# Altium project DD2090_4CAM_FFC_R2M1E2.PrjPcb (part 5 of 5)

## Sheet DD2090_4CAM_FFC_Connector_B.SchDoc: =project_title
size Tabloid; CompanyName: Luxonis Holding; DrawnBy: Dan Dunga; Organization: Luxonis Holding; Address1: 1925 Harmony Park Drive; Address2: Westminster, CO; Address3: 80234; Address4: United States; DocumentNumber: D0000190; SheetNumber: 4; SheetTotal: 12
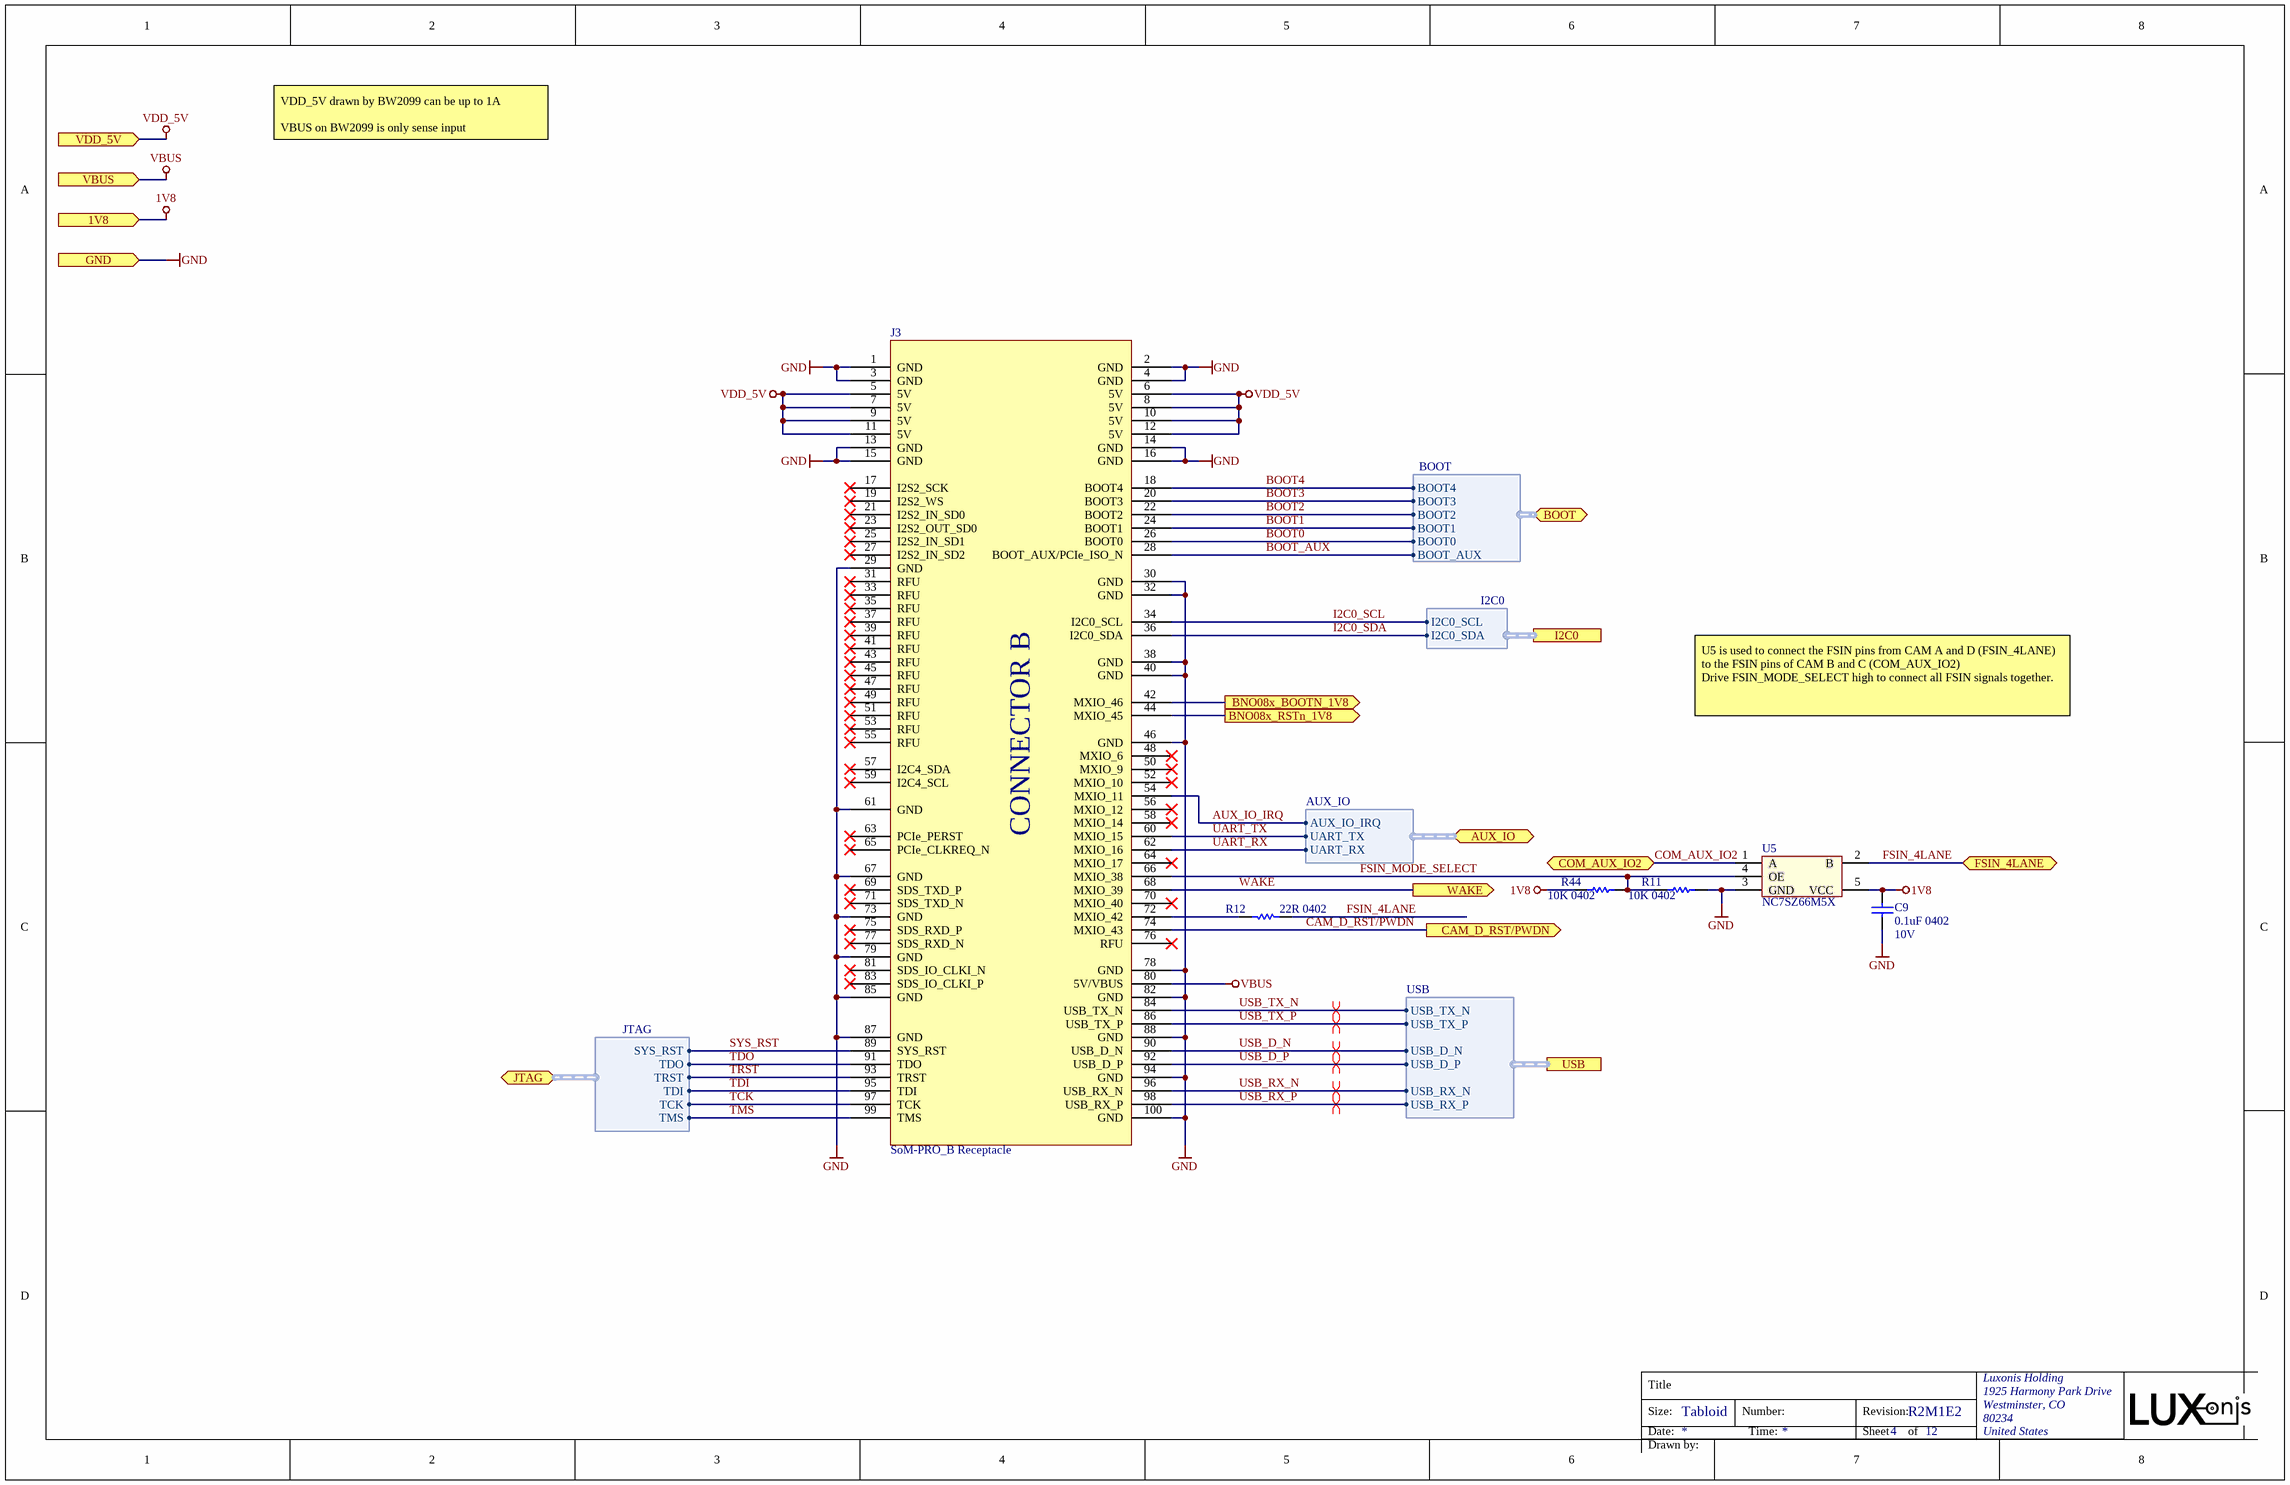
[diagram p9: DD2090_4CAM_FFC_Connector_B.SchDoc]

### Parts
C9  0.1uF 0402  Voltage Rating: 10V  [CAPC0402(1005)70_L]
J3  SoM-PRO_B Receptacle  [CON_B_BW2099_SoM_DF40HC-3.0-100DS-0.4V_minpad]
R11  10K 0402  [RESC0402(1005)_L]
R12  22R 0402  [RESC0402(1005)_N]
R44  10K 0402  [RESC0402(1005)_L]
U5  NC7SZ66M5X  [SOT235]

### Ports
1V8 (in), AUX_IO (bidir, harness AUX_IO), BNO08x_BOOTN_1V8 (out), BNO08x_RSTn_1V8 (out), BOOT (bidir, harness BOOT), CAM_D_RST/PWDN (out), COM_AUX_IO2 (bidir), FSIN_4LANE (bidir), GND (in), I2C0 (harness I2C0), JTAG (bidir, harness JTAG), USB (harness USB), VBUS (in), VDD_5V (in), WAKE (out)

### Harnesses
JTAG: SYS_RST, TDO, TRST, TDI, TCK, TMS
USB: USB_TX_N, USB_TX_P, USB_RX_N, USB_RX_P, USB_D_P, USB_D_N
BOOT: BOOT4, BOOT3, BOOT2, BOOT1, BOOT0, BOOT_AUX
AUX_IO: AUX_IO_IRQ, UART_TX, UART_RX
I2C0: I2C0_SCL, I2C0_SDA

### Nets
1V8: C9.2 R44.2 U5.5(VCC) ; port 1V8
GND: C9.1 J3.1(GND) J3.2(GND) J3.3(GND) J3.4(GND) J3.13(GND) J3.14(GND) J3.15(GND) J3.16(GND) J3.29(GND) J3.30(GND) J3.32(GND) J3.38(GND) J3.40(GND) J3.46(GND) J3.61(GND) J3.67(GND) J3.73(GND) J3.78(GND) J3.79(GND) J3.82(GND) J3.85(GND) J3.87(GND) J3.88(GND) J3.94(GND) J3.100(GND) R11.1 U5.3(GND) ; port GND
VBUS: J3.80(5V/VBUS) ; port VBUS
VDD_5V: J3.5(5V) J3.6(5V) J3.7(5V) J3.8(5V) J3.9(5V) J3.10(5V) J3.11(5V) J3.12(5V) ; port VDD_5V
AUX_IO_IRQ: J3.54(MXIO_11) ; port AUX_IO.AUX_IO_IRQ
BNO08x_BOOTN_1V8: J3.42(MXIO_46) ; port BNO08x_BOOTN_1V8
BNO08x_RSTn_1V8: J3.44(MXIO_45) ; port BNO08x_RSTn_1V8
BOOT0: J3.26(BOOT0) ; port BOOT.BOOT0
BOOT1: J3.24(BOOT1) ; port BOOT.BOOT1
BOOT2: J3.22(BOOT2) ; port BOOT.BOOT2
BOOT3: J3.20(BOOT3) ; port BOOT.BOOT3
BOOT4: J3.18(BOOT4) ; port BOOT.BOOT4
BOOT_AUX: J3.28(BOOT_AUX/PCIe_ISO_N) ; port BOOT.BOOT_AUX
CAM_D_RST/PWDN: J3.74(MXIO_43) ; port CAM_D_RST/PWDN  [project net CAM2_RST]
COM_AUX_IO2: U5.1(A) ; port COM_AUX_IO2
FSIN_4LANE: R12.1 U5.2(B) ; port FSIN_4LANE
FSIN_MODE_SELECT: J3.66(MXIO_38) R11.2 R44.1 U5.4(OE)
I2C0_SCL: J3.34(I2C0_SCL) ; port I2C0.I2C0_SCL
I2C0_SDA: J3.36(I2C0_SDA) ; port I2C0.I2C0_SDA
SYS_RST: J3.89(SYS_RST) ; port JTAG.SYS_RST
TCK: J3.97(TCK) ; port JTAG.TCK
TDI: J3.95(TDI) ; port JTAG.TDI
TDO: J3.91(TDO) ; port JTAG.TDO
TMS: J3.99(TMS) ; port JTAG.TMS
TRST: J3.93(TRST) ; port JTAG.TRST
UART_RX: J3.62(MXIO_16) ; port AUX_IO.UART_RX
UART_TX: J3.60(MXIO_15) ; port AUX_IO.UART_TX
USB_D_N: J3.90(USB_D_N) ; port USB.USB_D_N
USB_D_P: J3.92(USB_D_P) ; port USB.USB_D_P
USB_RX_N: J3.96(USB_RX_N) ; port USB.USB_RX_N
USB_RX_P: J3.98(USB_RX_P) ; port USB.USB_RX_P
USB_TX_N: J3.84(USB_TX_N) ; port USB.USB_TX_N
USB_TX_P: J3.86(USB_TX_P) ; port USB.USB_TX_P
WAKE: J3.68(MXIO_39) ; port WAKE
NetJ3_72: J3.72(MXIO_42) R12.2

Not connected (* = marked no-connect by the designer): J3 17(I2S2_SCK)* 19(I2S2_WS)* 21(I2S2_IN_SD0)* 23(I2S2_OUT_SD0)* 25(I2S2_IN_SD1)* 27(I2S2_IN_SD2)* 31(RFU)* 33(RFU)* 35(RFU)* 37(RFU)* 39(RFU)* 41(RFU)* 43(RFU)* 45(RFU)* 47(RFU)* 48(MXIO_6)* 49(RFU)* 50(MXIO_9)* 51(RFU)* 52(MXIO_10)* 53(RFU)* 55(RFU)* 56(MXIO_12)* 57(I2C4_SDA)* 58(MXIO_14)* 59(I2C4_SCL)* 63(PCIe_PERST)* 64(MXIO_17)* 65(PCIe_CLKREQ_N)* 69(SDS_TXD_P)* 70(MXIO_40)* 71(SDS_TXD_N)* 75(SDS_RXD_P)* 76(RFU)* 77(SDS_RXD_N)* 81(SDS_IO_CLKI_N)* 83(SDS_IO_CLKI_P)*

### Layout directives
differential pair; differential pair class 90ohm: USB_D_N, USB_D_P, USB_RX_N, USB_RX_P, USB_TX_N, USB_TX_P

### Notes on the sheet
- VDD_5V drawn by BW2099 can be up to 1A
  VBUS on BW2099 is only sense input
- U5 is used to connect the FSIN pins from CAM A and D (FSIN_4LANE) to the FSIN pins of CAM B and C (COM_AUX_IO2)
  Drive FSIN_MODE_SELECT high to connect all FSIN signals together.
- Title
- Size:
- Date:
- Tabloid
- Number:
- Time:
- Revision:
- Sheet
- of
- Drawn by:
- (in symbol DF40HC(3.0)-100DS-0.4V_SoM-PRO_B) CONNECTOR B

### Library data of the parts
C9 = GRM155R71A104JA01D: CAP CER 0.1UF 10V X7R 0402 5%; Manufacturer 1: Murata; Capacitance: 100nF; Supplier 1: Digi-Key; Manufacturer Part Number 1: GRM155R71A104JA01D; Stock 1: 1346709; Pricing 1: 1=0.10000, 10=0.02500, 100=0.01130, 500=0.00806, 1000=0.00633, 2500=0.00575, 5000=0.00529 (USD); RoHS: Yes; Mount: Surface Mount; Case/Package: 0402; Case Code (Imperial): 0402; Case Code (Metric): 1005; Min Operating Temperature: -55°C; Max Operating Temperature: 125°C; Tolerance: 5%; Packaging: Tape and Reel; Voltage Rating (DC): 10V; Dielectric: X7R; Package Quantity: 10000; Termination: SMD/SMT; Length: 1mm; Height: 0.5mm; Width: 0.02inch; Thickness: 0.022inch; Depth: 0.5mm; Radiation Hardening: No; Lead Free: Lead Free; ComponentLink1URL: https://datasheet.ciiva.com/5411/product-5411135.pdf?src-supplier=Mouser; ComponentLink1Description: https://datasheet.ciiva.com/5411/product-5411135.pdf?src-supplier=Mouser; ComponentLink2URL: https://datasheet.ciiva.com/11618/c02e-11618821.pdf?src-supplier=Avnet; ComponentLink2Description: https://datasheet.ciiva.com/11618/c02e-11618821.pdf?src-supplier=Avnet; Supplier Part Number 1: 490-10777-1-ND
J3 = DF40HC(3.0)-100DS-0.4V_SoM-PRO_B: CONN RCPT 100POS 0.4MM SMD GOLD; Manufacturer 1: Hirose; Manufacturer Part Number 1: DF40HC(3.0)-100DS-0.4V(58); Number of Positions: 100; Pitch: 0.016inch; System: Connector; RoHS: Yes; Mount: Surface Mount; Contact Plating: Gold; Packaging: Tape and Reel; Number of Rows: 2; Package Quantity: 1000; Connector Type: Receptacle; Lead Free: Lead Free; ComponentLink1URL: https://datasheet.ciiva.com/46636/ed-df40-20140305-46636517.pdf?src-supplier=Digi-Key; ComponentLink1Description: https://datasheet.ciiva.com/46636/ed-df40-20140305-46636517.pdf?src-supplier=Digi-Key; ComponentLink2URL: https://datasheet.ciiva.com/18562/ed-df40-20140305-18562189.pdf?src-supplier=Digi-Key; ComponentLink2Description: https://datasheet.ciiva.com/18562/ed-df40-20140305-18562189.pdf?src-supplier=Digi-Key; ComponentLink3URL: https://datasheet.ciiva.com/13559/ed-df40-20140305-13559540.pdf?src-supplier=Mouser; ComponentLink3Description: https://datasheet.ciiva.com/13559/ed-df40-20140305-13559540.pdf?src-supplier=Mouser; ComponentLink4URL: https://datasheet.ciiva.com/18562/ed-df40-20140305-18562462.pdf?src-supplier=Digi-Key; ComponentLink4Description: https://datasheet.ciiva.com/18562/ed-df40-20140305-18562462.pdf?src-supplier=Digi-Key; Supplier 1: Mouser; Stock 1: 2172; Pricing 1: 1=2.54000, 10=2.26000, 25=2.07000, 50=2.07000, 100=1.98000, 250=1.79000, 500=1.65000, 1000=1.41000, 3000=1.32000, 6000=1.23000, 10000=1.23000 (USD); Supplier 2: Mouser; Stock 2: 2078; Pricing 2: 1=2.50000, 10=2.40000, 25=2.10000, 50=2.10000, 100=2.00000, 250=1.76000, 500=1.71000, 1000=1.45000, 2000=1.36000, 5000=1.31000, 10000=1.31000 (USD); Supplier Part Number 1: 798-DF40HC30100DS451; Supplier Part Number 2: 798-DF40HC30100DS458
R11 R44 = RC0402FR-1310KL: RES SMD 10K OHM 1% 0402 1/16W Chip Resistor, 0402 [1005 Metric], 10 kohm, RC Series, 50 V, Thick Film, 62.5 mW; Manufacturer 1: Yageo; Resistance: 10kR; Temperature Coefficient: 100ppm/°C; Power Rating: 62.5mW; Voltage Rating: 50V; ComponentLink1URL: https://datasheet.ciiva.com/16940/pyu-rc0402-51-rohs-l-6-16940293.pdf?src-supplier=Avnet+Europe; ComponentLink1Description: https://datasheet.ciiva.com/16940/pyu-rc0402-51-rohs-l-6-16940293.pdf?src-supplier=Avnet+Europe; ComponentLink2URL: https://datasheet.ciiva.com/28386/pyu-rc0402-51-rohs-l-6-28386855.pdf?src-supplier=Avnet+Europe; ComponentLink2Description: https://datasheet.ciiva.com/28386/pyu-rc0402-51-rohs-l-6-28386855.pdf?src-supplier=Avnet+Europe; ComponentLink3URL: https://datasheet.ciiva.com/16740/pyu-rc0402-51-rohs-l-6-r-16740602.pdf?src-supplier=Future+Electronics; ComponentLink3Description: https://datasheet.ciiva.com/16740/pyu-rc0402-51-rohs-l-6-r-16740602.pdf?src-supplier=Future+Electronics; ComponentLink4URL: https://datasheet.ciiva.com/8891/pyu-rc0402-51-rohs-l-6-8891339.pdf?src-supplier=Avnet; ComponentLink4Description: https://datasheet.ciiva.com/8891/pyu-rc0402-51-rohs-l-6-8891339.pdf?src-supplier=Avnet; ComponentLink5URL: https://datasheet.ciiva.com/5557/pyu-rc0402-51-rohs-l-6-r-5557997.pdf?src-supplier=Mouser; ComponentLink5Description: https://datasheet.ciiva.com/5557/pyu-rc0402-51-rohs-l-6-r-5557997.pdf?src-supplier=Mouser; ComponentLink6URL: https://datasheet.ciiva.com/7983/1018594-7983533.pdf?src-supplier=Element14; ComponentLink6Description: https://datasheet.ciiva.com/7983/1018594-7983533.pdf?src-supplier=Element14; Supplier 1: Newark; Manufacturer Part Number 1: RC0402FR-1310KL; Stock 1: 62239; Pricing 1: 1=0.10000, 25=0.01200, 100=0.00400, 250=0.00400, 500=0.00300, 1000=0.00300 (USD); RoHS: Yes; Case/Package: 0402; Number of Pins: 2; Contact Plating: Tin,Matte,Lead; Case Code (Imperial): 0402; Case Code (Metric): 1005; Min Operating Temperature: -55°C; Max Operating Temperature: 155°C; Tolerance: 1%; Composition: Thick Film; Packaging: Tape and Reel; Termination: SMD/SMT; Military Standard: Not; Voltage Rating (DC): 50V; Working Voltage: 50V; Number of Terminations: 2; Length: 1mm; Depth: 0.5mm; Radiation Hardening: No; REACH SVHC: No SVHC; Lead Free: Lead Free; Supplier Part Number 1: 67R9960; Supplier 2: Future Electronics; Supplier 3: Mouser; Supplier 4: Element14; Supplier Part Number 2: RC0402FR-1310KL-CUTT; Supplier Part Number 3: 603-RC0402FR-1310KL; Supplier Part Number 4: 1799235
R12 = RC0402FR-0722RL: RES SMD 22 OHM 1% 1/16W 0402; Manufacturer 1: Yageo; Temperature Coefficient: 100ppm/°C; Power Rating: 63mW; Voltage Rating: 50V; Supplier 1: Digi-Key; Manufacturer Part Number 1: RC0402FR-0722RL; Stock 1: 23751364; Pricing 1: 10000=0.00163, 30000=0.00144, 50000=0.00132, 100000=0.00129 (USD); RoHS: Yes; Case/Package: 0402; Number of Pins: 2; Case Code (Metric): 1005; Case Code (Imperial): 0402; Min Operating Temperature: -55°C; Max Operating Temperature: 155°C; Tolerance: 1%; Resistance: 22R; Packaging: Tape and Reel; Composition: Thick Film; Voltage Rating (DC): 50V; Termination: SMD/SMT; Military Standard: Not; Length: 1mm; Height: 0.32mm; Width: 0.5mm; Depth: 0.5mm; REACH SVHC: Unknown; Lead Free: Lead Free; ComponentLink1URL: https://datasheet.ciiva.com/11819/0900766b80c66297-11819462.pdf?src-supplier=RSComponents; ComponentLink1Description: https://datasheet.ciiva.com/11819/0900766b80c66297-11819462.pdf?src-supplier=RSComponents; ComponentLink2URL: https://datasheet.ciiva.com/7849/1018594-7849911.pdf?src-supplier=Element14; ComponentLink2Description: https://datasheet.ciiva.com/7849/1018594-7849911.pdf?src-supplier=Element14; ComponentLink3URL: https://datasheet.ciiva.com/26829/getdatasheetpartid-554995-26829991.pdf?src-supplier=Verical; ComponentLink3Description: https://datasheet.ciiva.com/26829/getdatasheetpartid-554995-26829991.pdf?src-supplier=Verical; ComponentLink4URL: https://datasheet.ciiva.com/7849/1018594-7849912.pdf?src-supplier=Element14; ComponentLink4Description: https://datasheet.ciiva.com/7849/1018594-7849912.pdf?src-supplier=Element14; ComponentLink5URL: https://datasheet.ciiva.com/16930/pyu-rc0402-51-rohs-l-6-r-16930687.pdf?src-supplier=Future+Electronics; ComponentLink5Description: https://datasheet.ciiva.com/16930/pyu-rc0402-51-rohs-l-6-r-16930687.pdf?src-supplier=Future+Electronics; Supplier 2: Newark; Supplier 3: Mouser; Supplier Part Number 2: 26M6784; Supplier Part Number 3: 603-RC0402FR-0722RL; Supplier Part Number 1: 311-22.0LRTR-ND
U5 = NC7SZ66M5X: ANALOGUE SWITCH, SINGLE, SPST-NO, SOT-23; Analog Switch Type:SPST - NO; No. of Channels:1; On State Resistance Max:60ohm; Supply Voltage Range:1.65V to 5.5V; Analog Switch Case:SOT-23; No. of Pins:5; Operating Temperature Min:-40 C ;RoHS Compliant: Yes; Manufacturer 1: ON Semiconductor / Fairchild; Min Supply Voltage: 1.65V; Max Power Dissipation: 200mW; On-State Resistance: 5R; Turn-On Delay Time: 7ns; Turn-Off Delay Time: 9.2ns; Number of Channels: 1; Max Supply Current: 10uA; Throw Configuration: SPST; High Level Output Current: 128mA; Quiescent Current: 50nA; Polarity: Non-Inverting; Voltage: 5V; Supplier 1: Digi-Key; Manufacturer Part Number 1: NC7SZ66M5X; RoHS: Yes; Category: Decoders and Multiplexers; Stock 1: 12120; Pricing 1: 1=0.39000, 10=0.32000, 25=0.29280, 100=0.21780, 250=0.19736, 500=0.16332, 1000=0.12249 (USD); Mount: Surface Mount; Case/Package: SOT-23-5; Number of Pins: 5; Weight: 0.001058oz; Contact Plating: Tin,Matte; Min Operating Temperature: -40°C; Max Operating Temperature: 85°C; Packaging: Tape and Reel; Max Supply Voltage: 5.5V; Package Quantity: 1; Supply Type: Single; Number of Inputs: 1; Number of Outputs: 1; Independent Circuits: 1; Power Dissipation: 200mW; Number of Circuits: 1; Number of Bits: 1; Length: 3mm; Width: 1.7mm; Height: 1.3mm; Radiation Hardening: No; RoHS Compliant: Yes; Lead Free: Lead Free; REACH SVHC: No SVHC; ComponentLink1URL: https://datasheet.ciiva.com/4917/nc7sz66-98769-4917648.pdf?src-supplier=Mouser; ComponentLink1Description: https://datasheet.ciiva.com/4917/nc7sz66-98769-4917648.pdf?src-supplier=Mouser; ComponentLink2URL: https://datasheet.ciiva.com/15127/getdatasheetpartid-142529-15127273.pdf?src-supplier=Verical; ComponentLink2Description: https://datasheet.ciiva.com/15127/getdatasheetpartid-142529-15127273.pdf?src-supplier=Verical; ComponentLink3URL: https://datasheet.ciiva.com/34301/1021815-34301882.pdf?src-supplier=Jameco; ComponentLink3Description: https://datasheet.ciiva.com/34301/1021815-34301882.pdf?src-supplier=Jameco; ComponentLink4URL: https://datasheet.ciiva.com/1514/1751945-1514528.pdf?src-supplier=Element14; ComponentLink4Description: https://datasheet.ciiva.com/1514/1751945-1514528.pdf?src-supplier=Element14; ComponentLink5URL: https://datasheet.ciiva.com/2980/nc7sz66-2980326.pdf?src-supplier=Avnet; ComponentLink5Description: https://datasheet.ciiva.com/2980/nc7sz66-2980326.pdf?src-supplier=Avnet; ComponentLink6URL: https://datasheet.ciiva.com/26240/nc7sz66-26240518.pdf?src-supplier=Avnet+Europe; ComponentLink6Description: https://datasheet.ciiva.com/26240/nc7sz66-26240518.pdf?src-supplier=Avnet+Europe; ComponentLink7URL: https://datasheet.ciiva.com/1888/nc7sz66-1888140.pdf?src-supplier=Digi-Key; ComponentLink7Description: https://datasheet.ciiva.com/1888/nc7sz66-1888140.pdf?src-supplier=Digi-Key; ComponentLink8URL: https://datasheet.ciiva.com/1888/nc7sz66-1888141.pdf?src-supplier=Digi-Key; ComponentLink8Description: https://datasheet.ciiva.com/1888/nc7sz66-1888141.pdf?src-supplier=Digi-Key; ComponentLink9URL: https://datasheet.ciiva.com/1888/nc7sz66-1888142.pdf?src-supplier=Digi-Key; ComponentLink9Description: https://datasheet.ciiva.com/1888/nc7sz66-1888142.pdf?src-supplier=Digi-Key

## Sheet DD2090_4CAM_FFC_EEPROM.SchDoc: =project_title
size Tabloid; PageSetup: Record=PageOptions|CenterHorizontal=True|CenterVertical=True|PrintScale=0.73|XCorrection=1.00|YCorrection=1.00|PrintKind=0|BorderSize=5000000|LeftOffset=0|BottomOffset=0|Orientation=2|PaperLength=1000|PaperWidth=1000|Scale=100|PaperSource=7|PrintQuality=-4|MediaType=1|DitherType=10|PaperKind=A4|PrintScaleMode=1; CompanyName: Luxonis Holding; DrawnBy: Dan Dunga; Organization: Luxonis Holding; Address1: 1925 Harmony Park Drive; Address2: Westminster, CO; Address3: 80234; Address4: United States; DocumentNumber: D0000190; SheetNumber: 11; SheetTotal: 11
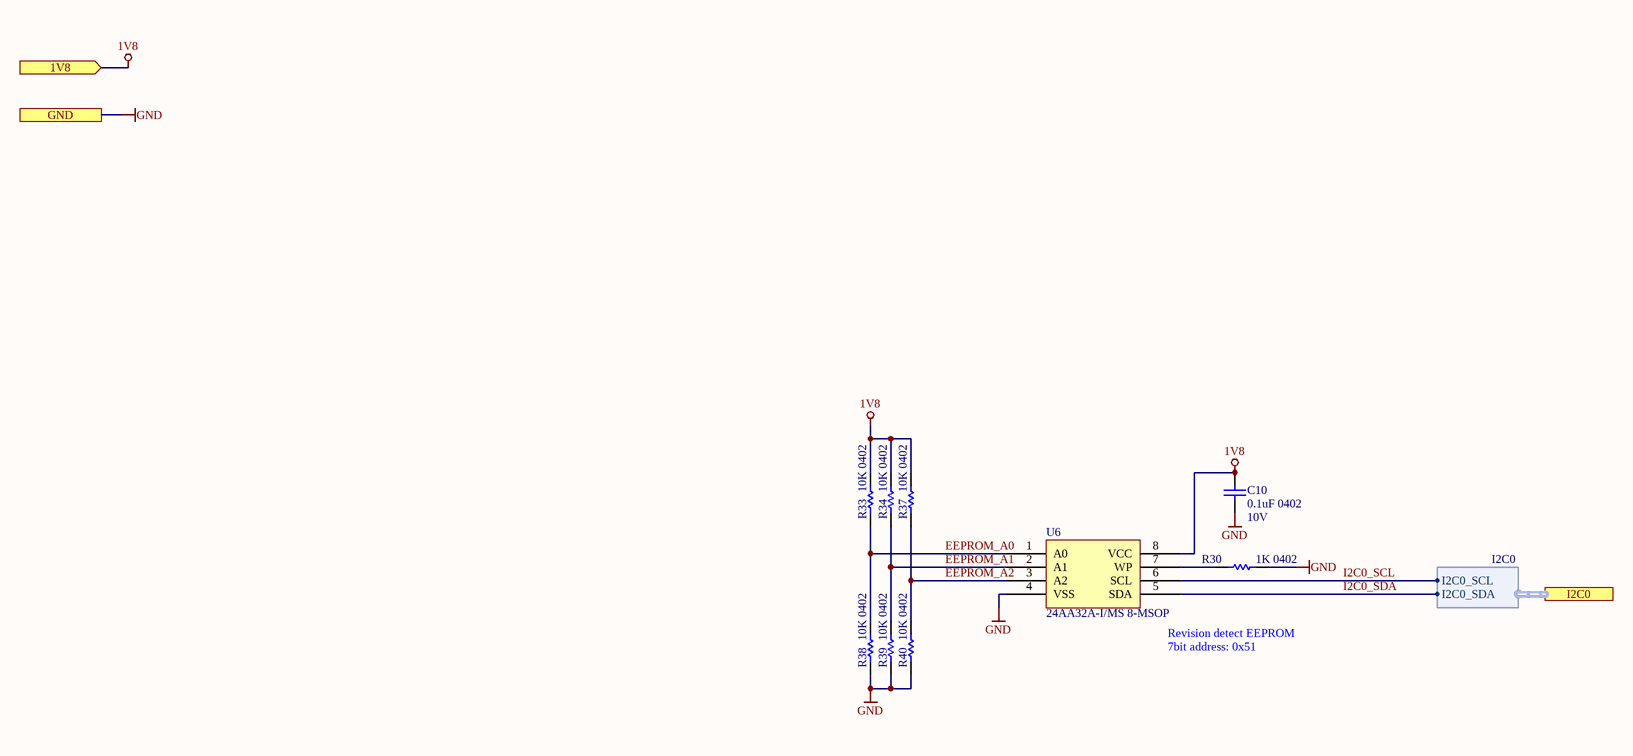
[diagram p10: DD2090_4CAM_FFC_EEPROM.SchDoc]

### Parts
C10  0.1uF 0402  Voltage Rating: 10V  [CAPC0402(1005)70_L]
R30  1K 0402  [RESC0402(1005)_L]
R33  10K 0402  [RESC0402(1005)_L]
R34  10K 0402  [RESC0402(1005)_L]
R37  10K 0402  [RESC0402(1005)_L]
R38  10K 0402  [RESC0402(1005)_L]
R39  10K 0402  [RESC0402(1005)_L]
R40  10K 0402  [RESC0402(1005)_L]
U6  24AA32A-I/MS 8-MSOP  [24AA32A-I/MS]

### Ports
1V8 (in), GND, I2C0 (harness I2C0)

### Harnesses
I2C0: I2C0_SCL, I2C0_SDA

### Nets
1V8: C10.2 R33.2 R34.2 R37.2 U6.8(VCC) ; port 1V8
GND: C10.1 R30.1 R38.1 R39.1 R40.1 U6.4(VSS) ; port GND
EEPROM_A0: R33.1 R38.2 U6.1(A0)
EEPROM_A1: R34.1 R39.2 U6.2(A1)
EEPROM_A2: R37.1 R40.2 U6.3(A2)
I2C0_SCL: U6.6(SCL) ; port I2C0.I2C0_SCL
I2C0_SDA: U6.5(SDA) ; port I2C0.I2C0_SDA
NetR30_2: R30.2 U6.7(WP)

### Notes on the sheet
- (near U6) Revision detect EEPROM
- (near U6) 7bit address: 0x51
- Title
- Size:
- Date:
- Tabloid
- Number:
- Time:
- Revision:
- Sheet
- of
- Drawn by:

### Library data of the parts
C10 = GRM155R71A104JA01D: as C9 on sheet DD2090_4CAM_FFC_Connector_B; Supplier 1: Digi-Key; Manufacturer Part Number 1: GRM155R71A104JA01D; Stock 1: 1346709; Pricing 1: 1=0.10000, 10=0.02500, 100=0.01130, 500=0.00806, 1000=0.00633, 2500=0.00575, 5000=0.00529 (USD); RoHS: Yes; Mount: Surface Mount; Case/Package: 0402; Case Code (Imperial): 0402; Case Code (Metric): 1005; Min Operating Temperature: -55°C; Max Operating Temperature: 125°C; Tolerance: 5%; Packaging: Tape and Reel; Voltage Rating (DC): 10V; Dielectric: X7R; Package Quantity: 10000; Termination: SMD/SMT; Length: 1mm; Height: 0.5mm; Width: 0.02inch; Thickness: 0.022inch; Depth: 0.5mm; Radiation Hardening: No; Lead Free: Lead Free; ComponentLink1URL: https://datasheet.ciiva.com/5411/product-5411135.pdf?src-supplier=Mouser; ComponentLink1Description: https://datasheet.ciiva.com/5411/product-5411135.pdf?src-supplier=Mouser; ComponentLink2URL: https://datasheet.ciiva.com/11618/c02e-11618821.pdf?src-supplier=Avnet; ComponentLink2Description: https://datasheet.ciiva.com/11618/c02e-11618821.pdf?src-supplier=Avnet; Supplier Part Number 1: 490-10777-1-ND
R30 = RC0402FR-071KL: RES SMD 1K OHM 1% 1/16W 0402; Manufacturer 1: Yageo; Temperature Coefficient: 100ppm/°C; Power Rating: 62.5mW; Voltage Rating (DC): 50V; Resistance: 1kR; RoHS: Yes; Number of Pins: 2; Case Code (Imperial): 0402; Case Code (Metric): 1005; Min Operating Temperature: -55°C; Max Operating Temperature: 155°C; Packaging: Tape and Reel; Composition: Thick Film; Voltage Rating: 50V; Military Standard: Not; Termination: SMD/SMT; Length: 1mm; Height: 0.32mm; Width: 0.5mm; Depth: 0.5mm; Lead Free: Lead Free; REACH SVHC: Unknown; ComponentLink1URL: https://datasheet.ciiva.com/11819/0900766b80c66297-11819477.pdf?src-supplier=RSComponents; ComponentLink1Description: https://datasheet.ciiva.com/11819/0900766b80c66297-11819477.pdf?src-supplier=RSComponents; ComponentLink2URL: https://datasheet.ciiva.com/12666/pyu-rc0402-51-rohs-l-6-r-12666741.pdf?src-supplier=Mouser; ComponentLink2Description: https://datasheet.ciiva.com/12666/pyu-rc0402-51-rohs-l-6-r-12666741.pdf?src-supplier=Mouser; ComponentLink3URL: https://datasheet.ciiva.com/17063/pyu-rc0402-51-rohs-l-6-r-17063193.pdf?src-supplier=Future+Electronics; ComponentLink3Description: https://datasheet.ciiva.com/17063/pyu-rc0402-51-rohs-l-6-r-17063193.pdf?src-supplier=Future+Electronics; ComponentLink4URL: https://datasheet.ciiva.com/22747/1018594-22747513.pdf?src-supplier=Element14; ComponentLink4Description: https://datasheet.ciiva.com/22747/1018594-22747513.pdf?src-supplier=Element14; ComponentLink5URL: https://datasheet.ciiva.com/7849/1018594-7849869.pdf?src-supplier=Element14; ComponentLink5Description: https://datasheet.ciiva.com/7849/1018594-7849869.pdf?src-supplier=Element14; ComponentLink6URL: https://datasheet.ciiva.com/7983/1018594-7983502.pdf?src-supplier=Element14; ComponentLink6Description: https://datasheet.ciiva.com/7983/1018594-7983502.pdf?src-supplier=Element14; ComponentLink7URL: https://datasheet.ciiva.com/7849/1018594-7849871.pdf?src-supplier=Element14; ComponentLink7Description: https://datasheet.ciiva.com/7849/1018594-7849871.pdf?src-supplier=Element14; Supplier 1: Digi-Key; Manufacturer Part Number 1: RC0402FR-071KL; Stock 1: 60695854; Pricing 1: 1=0.10000, 10=0.01600, 100=0.00670, 1000=0.00301, 2500=0.00261, 5000=0.00215 (USD); Case/Package: 0402; Tolerance: 1%; Supplier Part Number 1: 311-1.00KLRCT-ND
R33 R34 R37-R40 = RC0402FR-1310KL: as R11 on sheet DD2090_4CAM_FFC_Connector_B; ComponentLink1URL: https://datasheet.ciiva.com/16940/pyu-rc0402-51-rohs-l-6-16940293.pdf?src-supplier=Avnet+Europe; ComponentLink1Description: https://datasheet.ciiva.com/16940/pyu-rc0402-51-rohs-l-6-16940293.pdf?src-supplier=Avnet+Europe; ComponentLink2URL: https://datasheet.ciiva.com/28386/pyu-rc0402-51-rohs-l-6-28386855.pdf?src-supplier=Avnet+Europe; ComponentLink2Description: https://datasheet.ciiva.com/28386/pyu-rc0402-51-rohs-l-6-28386855.pdf?src-supplier=Avnet+Europe; ComponentLink3URL: https://datasheet.ciiva.com/16740/pyu-rc0402-51-rohs-l-6-r-16740602.pdf?src-supplier=Future+Electronics; ComponentLink3Description: https://datasheet.ciiva.com/16740/pyu-rc0402-51-rohs-l-6-r-16740602.pdf?src-supplier=Future+Electronics; ComponentLink4URL: https://datasheet.ciiva.com/8891/pyu-rc0402-51-rohs-l-6-8891339.pdf?src-supplier=Avnet; ComponentLink4Description: https://datasheet.ciiva.com/8891/pyu-rc0402-51-rohs-l-6-8891339.pdf?src-supplier=Avnet; ComponentLink5URL: https://datasheet.ciiva.com/5557/pyu-rc0402-51-rohs-l-6-r-5557997.pdf?src-supplier=Mouser; ComponentLink5Description: https://datasheet.ciiva.com/5557/pyu-rc0402-51-rohs-l-6-r-5557997.pdf?src-supplier=Mouser; ComponentLink6URL: https://datasheet.ciiva.com/7983/1018594-7983533.pdf?src-supplier=Element14; ComponentLink6Description: https://datasheet.ciiva.com/7983/1018594-7983533.pdf?src-supplier=Element14; Supplier 1: Newark; Manufacturer Part Number 1: RC0402FR-1310KL; Stock 1: 62239; Pricing 1: 1=0.10000, 25=0.01200, 100=0.00400, 250=0.00400, 500=0.00300, 1000=0.00300 (USD); RoHS: Yes; Case/Package: 0402; Number of Pins: 2; Contact Plating: Tin,Matte,Lead; Case Code (Imperial): 0402; Case Code (Metric): 1005; Min Operating Temperature: -55°C; Max Operating Temperature: 155°C; Tolerance: 1%; Composition: Thick Film; Packaging: Tape and Reel; Termination: SMD/SMT; Military Standard: Not; Voltage Rating (DC): 50V; Working Voltage: 50V; Number of Terminations: 2; Length: 1mm; Depth: 0.5mm; Radiation Hardening: No; REACH SVHC: No SVHC; Lead Free: Lead Free; Supplier Part Number 1: 67R9960; Supplier 2: Future Electronics; Supplier 3: Mouser; Supplier 4: Element14; Supplier Part Number 2: RC0402FR-1310KL-CUTT; Supplier Part Number 3: 603-RC0402FR-1310KL; Supplier Part Number 4: 1799235
U6 = 24AA32A-I/MS: IC EEPROM 32K I2C 400KHZ 8MSOP Memory IC 32Kb (4K x 8) I²C 400kHz 900ns 8-MSOP; Manufacturer 1: Microchip; Interface: I2C,Serial,2-Wire; Access Time: 3500ns; Max Supply Voltage: 5.5V; Min Supply Voltage: 1.7V; Nominal Supply Current: 3mA; Supplier 1: Digi-Key; Stock 1: 4213; Pricing 1: 1=0.39000, 25=0.38120, 100=0.36050 (USD); RoHS: Yes; Mount: Surface Mount; Case/Package: MSOP; Number of Pins: 8; Contact Plating: Tin,Matte; Min Operating Temperature: -40°C; Max Operating Temperature: 85°C; Max Frequency: 400kHz; Frequency: 400kHz; Packaging: Rail/Tube; Density: 32Kb; Memory Size: 32Kb; Package Quantity: 100; Length: 3mm; Height: 0.85mm; Width: 3mm; Radiation Hardening: No; Lead Free: Lead Free; REACH SVHC: No SVHC; ComponentLink1URL: https://datasheet.ciiva.com/16309/filehandler-aspxddocname-en011853-16309808.pdf?src-supplier=Future+Electronics; ComponentLink1Description: https://datasheet.ciiva.com/16309/filehandler-aspxddocname-en011853-16309808.pdf?src-supplier=Future+Electronics; ComponentLink2URL: https://datasheet.ciiva.com/16621/21713l-16621382.pdf?src-supplier=Avnet+Europe; ComponentLink2Description: https://datasheet.ciiva.com/16621/21713l-16621382.pdf?src-supplier=Avnet+Europe; ComponentLink3URL: https://datasheet.ciiva.com/3185/21713l-3185209.pdf?src-supplier=Avnet; ComponentLink3Description: https://datasheet.ciiva.com/3185/21713l-3185209.pdf?src-supplier=Avnet; ComponentLink4URL: https://datasheet.ciiva.com/1154/1688094-1154810.pdf?src-supplier=Element14; ComponentLink4Description: https://datasheet.ciiva.com/1154/1688094-1154810.pdf?src-supplier=Element14; ComponentLink5URL: https://datasheet.ciiva.com/41454/001085239-da-01-en-ic-eeprom-32kbit-24aa32a-i-ms-msop-8-mcp-41454934.pdf?src-supplier=Conrad; ComponentLink5Description: https://datasheet.ciiva.com/41454/001085239-da-01-en-ic-eeprom-32kbit-24aa32a-i-ms-msop-8-mcp-41454934.pdf?src-supplier=Conrad; Supplier Part Number 1: 24AA32A-I/MS-ND; Memory Type: EEPROM; Manufacturer Part Number 1: 24AA32A-I/MS; Supplier 2: Mouser; Supplier 3: Newark; Supplier Part Number 2: 579-24AA32A-I/MS; Supplier Part Number 3: 38AH9658

## Nets that join several sheets
1V8: DD2090_4CAM_FFC_Power_Supply (C7.2 TP8.1 U4.5), DD2090_4CAM_FFC_IMU (9 pins), DD2090_4CAM_FFC_BOOT_JTAG_SD (8 pins), DD2090_4CAM_FFC_Connector_B (C9.2 R44.2 U5.5), DD2090_4CAM_FFC_EEPROM (5 pins)
3V3: DD2090_4CAM_FFC_USB (7 pins), DD2090_4CAM_FFC_Power_Supply (8 pins), DD2090_4CAM_FFC_IMU (5 pins), DD2090_4CAM_FFC_BOOT_JTAG_SD (C55.2 J7.4 J11.9), DD2090_4CAM_FFC_MIPI_2LANE_CAM (J8.25 J8.26 J9.25 J9.26), DD2090_4CAM_FFC_MIPI_4LANE_CAM (J6.25 J6.26 J10.25 J10.26)
GND: DD2090_4CAM_FFC_TopLevel (MTG7.1 MTG8.1), DD2090_4CAM_FFC_USB (30 pins), DD2090_4CAM_FFC_Power_Supply (24 pins), DD2090_4CAM_FFC_IMU (14 pins), DD2090_4CAM_FFC_BOOT_JTAG_SD (15 pins), DD2090_4CAM_FFC_MIPI_2LANE_CAM (26 pins), DD2090_4CAM_FFC_MIPI_4LANE_CAM (32 pins), DD2090_4CAM_FFC_Connector_A (39 pins), DD2090_4CAM_FFC_Connector_B (28 pins), DD2090_4CAM_FFC_EEPROM (6 pins)
VBUS: DD2090_4CAM_FFC_USB (10 pins), DD2090_4CAM_FFC_Power_Supply (R42.1 U2.1), DD2090_4CAM_FFC_Connector_B (J3.80)
VDD_5V: DD2090_4CAM_FFC_USB (C76.2 R213.2 R214.2 U62.12), DD2090_4CAM_FFC_Power_Supply (12 pins), DD2090_4CAM_FFC_Connector_A (J13.1 R3.2 R4.2 R15.2), DD2090_4CAM_FFC_Connector_B (8 pins)
AUX_IO_IRQ: DD2090_4CAM_FFC_Connector_A (J4.3), DD2090_4CAM_FFC_Connector_B (J3.54)
BNO08x_BOOTN_1V8: DD2090_4CAM_FFC_IMU (R36.2), DD2090_4CAM_FFC_Connector_B (J3.42)
BNO08x_CIPO_1V8: DD2090_4CAM_FFC_IMU (U7.1 U12.20), DD2090_4CAM_FFC_Connector_A (J1.64 J5.4)
BNO08x_COPI_1V8: DD2090_4CAM_FFC_IMU (U7.14 U12.17), DD2090_4CAM_FFC_Connector_A (J1.62 J5.2)
BNO08x_CS_1V8: DD2090_4CAM_FFC_IMU (U7.12 U12.18), DD2090_4CAM_FFC_Connector_A (J1.60 J5.7)
BNO08x_INT_1V8: DD2090_4CAM_FFC_IMU (TP25.1 U7.4 U12.14), DD2090_4CAM_FFC_Connector_A (J1.69)
BNO08x_RSTn_1V8: DD2090_4CAM_FFC_IMU (TP19.1 U12.11), DD2090_4CAM_FFC_Connector_B (J3.44)
BNO08x_SCK_1V8: DD2090_4CAM_FFC_IMU (U7.13 U12.19), DD2090_4CAM_FFC_Connector_A (J1.74 J5.1)
BOOT0: DD2090_4CAM_FFC_BOOT_JTAG_SD (R16.1 R23.1), DD2090_4CAM_FFC_Connector_B (J3.26)
BOOT1: DD2090_4CAM_FFC_BOOT_JTAG_SD (R22.1 R61.1), DD2090_4CAM_FFC_Connector_B (J3.24)
BOOT2: DD2090_4CAM_FFC_BOOT_JTAG_SD (R21.1 R28.1 R60.1), DD2090_4CAM_FFC_Connector_B (J3.22)
BOOT3: DD2090_4CAM_FFC_BOOT_JTAG_SD (R20.1 R24.1), DD2090_4CAM_FFC_Connector_B (J3.20)
BOOT4: DD2090_4CAM_FFC_BOOT_JTAG_SD (R9.1 R19.1 R29.1), DD2090_4CAM_FFC_Connector_B (J3.18)
BOOT_AUX: DD2090_4CAM_FFC_BOOT_JTAG_SD (R2.1 R41.1 R63.1), DD2090_4CAM_FFC_Connector_B (J3.28)
BOOT_SEL: DD2090_4CAM_FFC_BOOT_JTAG_SD (5 pins), DD2090_4CAM_FFC_Connector_A (J4.7 J13.4)
CAM1_CLK: DD2090_4CAM_FFC_MIPI_4LANE_CAM (8 pins), DD2090_4CAM_FFC_Connector_A (J1.28)
CAM1_RST: DD2090_4CAM_FFC_MIPI_4LANE_CAM (D10.4 D10.7 J6.17 TP3.1), DD2090_4CAM_FFC_Connector_A (J1.34)
CAM2_RST: DD2090_4CAM_FFC_MIPI_4LANE_CAM (D13.4 D13.7 J10.17 TP23.1), DD2090_4CAM_FFC_Connector_B (J3.74)
CAM_L_C_N: DD2090_4CAM_FFC_MIPI_2LANE_CAM (D7.1 D7.10 J8.8), DD2090_4CAM_FFC_Connector_A (J1.95)
CAM_L_C_P: DD2090_4CAM_FFC_MIPI_2LANE_CAM (D7.2 D7.9 J8.9), DD2090_4CAM_FFC_Connector_A (J1.97)
CAM_L_D0_N: DD2090_4CAM_FFC_MIPI_2LANE_CAM (D5.1 D5.10 J8.2), DD2090_4CAM_FFC_Connector_A (J1.89)
CAM_L_D0_P: DD2090_4CAM_FFC_MIPI_2LANE_CAM (D5.2 D5.9 J8.3), DD2090_4CAM_FFC_Connector_A (J1.91)
CAM_L_D1_N: DD2090_4CAM_FFC_MIPI_2LANE_CAM (D5.4 D5.7 J8.5), DD2090_4CAM_FFC_Connector_A (J1.83)
CAM_L_D1_P: DD2090_4CAM_FFC_MIPI_2LANE_CAM (D5.5 D5.6 J8.6), DD2090_4CAM_FFC_Connector_A (J1.85)
CAM_L_PWDN: DD2090_4CAM_FFC_MIPI_2LANE_CAM (D7.4 D7.7 J8.17 TP1.1), DD2090_4CAM_FFC_Connector_A (J1.67)
CAM_R_C_N: DD2090_4CAM_FFC_MIPI_2LANE_CAM (D11.1 D11.10 J9.8), DD2090_4CAM_FFC_Connector_A (J1.96)
CAM_R_C_P: DD2090_4CAM_FFC_MIPI_2LANE_CAM (D11.2 D11.9 J9.9), DD2090_4CAM_FFC_Connector_A (J1.98)
CAM_R_D0_N: DD2090_4CAM_FFC_MIPI_2LANE_CAM (D9.2 D9.9 J9.2), DD2090_4CAM_FFC_Connector_A (J1.90)
CAM_R_D0_P: DD2090_4CAM_FFC_MIPI_2LANE_CAM (D9.1 D9.10 J9.3), DD2090_4CAM_FFC_Connector_A (J1.92)
CAM_R_D1_N: DD2090_4CAM_FFC_MIPI_2LANE_CAM (D9.5 D9.6 J9.5), DD2090_4CAM_FFC_Connector_A (J1.84)
CAM_R_D1_P: DD2090_4CAM_FFC_MIPI_2LANE_CAM (D9.4 D9.7 J9.6), DD2090_4CAM_FFC_Connector_A (J1.86)
CAM_R_PWDN: DD2090_4CAM_FFC_MIPI_2LANE_CAM (D11.4 D11.7 J9.17 TP13.1), DD2090_4CAM_FFC_Connector_A (J1.65)
COM_AUX_IO2: DD2090_4CAM_FFC_MIPI_2LANE_CAM (R13.1 R14.1), DD2090_4CAM_FFC_Connector_A (R10.1 R27.1), DD2090_4CAM_FFC_Connector_B (U5.1)
FSIN_4LANE: DD2090_4CAM_FFC_MIPI_4LANE_CAM (R17.1 R18.1), DD2090_4CAM_FFC_Connector_A (J13.6), DD2090_4CAM_FFC_Connector_B (R12.1 U5.2)
I2C0_SCL: DD2090_4CAM_FFC_Connector_B (J3.34), DD2090_4CAM_FFC_EEPROM (U6.6)
I2C0_SDA: DD2090_4CAM_FFC_Connector_B (J3.36), DD2090_4CAM_FFC_EEPROM (U6.5)
I2C1_SCL: DD2090_4CAM_FFC_MIPI_4LANE_CAM (J6.20), DD2090_4CAM_FFC_Connector_A (J1.35)
I2C1_SDA: DD2090_4CAM_FFC_MIPI_4LANE_CAM (J6.21), DD2090_4CAM_FFC_Connector_A (J1.33)
I2C2_SCL: DD2090_4CAM_FFC_MIPI_2LANE_CAM (J8.20 J9.20), DD2090_4CAM_FFC_Connector_A (J1.77)
I2C2_SDA: DD2090_4CAM_FFC_MIPI_2LANE_CAM (J8.21 J9.21), DD2090_4CAM_FFC_Connector_A (J1.79)
I2C3_SCL: DD2090_4CAM_FFC_MIPI_4LANE_CAM (J10.20), DD2090_4CAM_FFC_Connector_A (J1.78 J4.2)
I2C3_SDA: DD2090_4CAM_FFC_MIPI_4LANE_CAM (J10.21), DD2090_4CAM_FFC_Connector_A (J1.80 J4.4)
MIPI1_C_N: DD2090_4CAM_FFC_MIPI_4LANE_CAM (D8.1 D8.10 J6.8), DD2090_4CAM_FFC_Connector_A (J1.3)
MIPI1_C_P: DD2090_4CAM_FFC_MIPI_4LANE_CAM (D8.2 D8.9 J6.9), DD2090_4CAM_FFC_Connector_A (J1.5)
MIPI1_D0_N: DD2090_4CAM_FFC_MIPI_4LANE_CAM (D6.1 D6.10 J6.2), DD2090_4CAM_FFC_Connector_A (J1.9)
MIPI1_D0_P: DD2090_4CAM_FFC_MIPI_4LANE_CAM (D6.2 D6.9 J6.3), DD2090_4CAM_FFC_Connector_A (J1.11)
MIPI1_D1_N: DD2090_4CAM_FFC_MIPI_4LANE_CAM (D6.4 D6.7 J6.5), DD2090_4CAM_FFC_Connector_A (J1.15)
MIPI1_D1_P: DD2090_4CAM_FFC_MIPI_4LANE_CAM (D6.5 D6.6 J6.6), DD2090_4CAM_FFC_Connector_A (J1.17)
MIPI1_D2_N: DD2090_4CAM_FFC_MIPI_4LANE_CAM (D8.4 D8.7 J6.11), DD2090_4CAM_FFC_Connector_A (J1.21)
MIPI1_D2_P: DD2090_4CAM_FFC_MIPI_4LANE_CAM (D8.5 D8.6 J6.12), DD2090_4CAM_FFC_Connector_A (J1.23)
MIPI1_D3_N: DD2090_4CAM_FFC_MIPI_4LANE_CAM (D10.1 D10.10 J6.14), DD2090_4CAM_FFC_Connector_A (J1.27)
MIPI1_D3_P: DD2090_4CAM_FFC_MIPI_4LANE_CAM (D10.2 D10.9 J6.15), DD2090_4CAM_FFC_Connector_A (J1.29)
MIPI2_C_N: DD2090_4CAM_FFC_MIPI_4LANE_CAM (D13.1 D13.10 J10.8), DD2090_4CAM_FFC_Connector_A (J1.4)
MIPI2_C_P: DD2090_4CAM_FFC_MIPI_4LANE_CAM (D13.2 D13.9 J10.9), DD2090_4CAM_FFC_Connector_A (J1.6)
MIPI2_D0_N: DD2090_4CAM_FFC_MIPI_4LANE_CAM (D12.1 D12.10 J10.2), DD2090_4CAM_FFC_Connector_A (J1.10)
MIPI2_D0_P: DD2090_4CAM_FFC_MIPI_4LANE_CAM (D12.2 D12.9 J10.3), DD2090_4CAM_FFC_Connector_A (J1.12)
MIPI2_D1_N: DD2090_4CAM_FFC_MIPI_4LANE_CAM (D12.4 D12.7 J10.5), DD2090_4CAM_FFC_Connector_A (J1.16)
MIPI2_D1_P: DD2090_4CAM_FFC_MIPI_4LANE_CAM (D12.5 D12.6 J10.6), DD2090_4CAM_FFC_Connector_A (J1.18)
MIPI2_D2_N: DD2090_4CAM_FFC_MIPI_4LANE_CAM (D14.1 D14.10 J10.11), DD2090_4CAM_FFC_Connector_A (J1.22)
MIPI2_D2_P: DD2090_4CAM_FFC_MIPI_4LANE_CAM (D14.2 D14.9 J10.12), DD2090_4CAM_FFC_Connector_A (J1.24)
MIPI2_D3_N: DD2090_4CAM_FFC_MIPI_4LANE_CAM (D14.4 D14.7 J10.14), DD2090_4CAM_FFC_Connector_A (J1.46)
MIPI2_D3_P: DD2090_4CAM_FFC_MIPI_4LANE_CAM (D14.5 D14.6 J10.15), DD2090_4CAM_FFC_Connector_A (J1.48)
SD_HST0_CD: DD2090_4CAM_FFC_BOOT_JTAG_SD (R66.2), DD2090_4CAM_FFC_Connector_A (J1.59)
SD_HST0_CLK: DD2090_4CAM_FFC_BOOT_JTAG_SD (J7.5), DD2090_4CAM_FFC_Connector_A (J1.61)
SD_HST0_CMD: DD2090_4CAM_FFC_BOOT_JTAG_SD (J7.3), DD2090_4CAM_FFC_Connector_A (J1.63)
SD_HST0_D0: DD2090_4CAM_FFC_BOOT_JTAG_SD (J7.7), DD2090_4CAM_FFC_Connector_A (J1.40)
SD_HST0_D1: DD2090_4CAM_FFC_BOOT_JTAG_SD (J7.8), DD2090_4CAM_FFC_Connector_A (J1.38)
SD_HST0_D2: DD2090_4CAM_FFC_BOOT_JTAG_SD (J7.1), DD2090_4CAM_FFC_Connector_A (J1.36)
SD_HST0_D3: DD2090_4CAM_FFC_BOOT_JTAG_SD (J7.2), DD2090_4CAM_FFC_Connector_A (J1.32)
STEREO_CLK: DD2090_4CAM_FFC_MIPI_2LANE_CAM (8 pins), DD2090_4CAM_FFC_Connector_A (J1.73)
SYS_RST: DD2090_4CAM_FFC_BOOT_JTAG_SD (J11.6), DD2090_4CAM_FFC_Connector_B (J3.89)
TCK: DD2090_4CAM_FFC_BOOT_JTAG_SD (J11.2), DD2090_4CAM_FFC_Connector_B (J3.97)
TDI: DD2090_4CAM_FFC_BOOT_JTAG_SD (J11.3), DD2090_4CAM_FFC_Connector_B (J3.95)
TDO: DD2090_4CAM_FFC_BOOT_JTAG_SD (J11.5), DD2090_4CAM_FFC_Connector_B (J3.91)
TMS: DD2090_4CAM_FFC_BOOT_JTAG_SD (J11.1), DD2090_4CAM_FFC_Connector_B (J3.99)
TRST: DD2090_4CAM_FFC_BOOT_JTAG_SD (J11.4), DD2090_4CAM_FFC_Connector_B (J3.93)
UART_RX: DD2090_4CAM_FFC_Connector_A (J4.6), DD2090_4CAM_FFC_Connector_B (J3.62)
UART_TX: DD2090_4CAM_FFC_Connector_A (J4.8), DD2090_4CAM_FFC_Connector_B (J3.60)
USB_D_N: DD2090_4CAM_FFC_USB (D17.2 D17.9 J14.A7 J14.B7), DD2090_4CAM_FFC_Connector_B (J3.90)
USB_D_P: DD2090_4CAM_FFC_USB (D17.1 D17.10 J14.A6 J14.B6), DD2090_4CAM_FFC_Connector_B (J3.92)
USB_RX_N: DD2090_4CAM_FFC_USB (U61.7), DD2090_4CAM_FFC_Connector_B (J3.96)
USB_RX_P: DD2090_4CAM_FFC_USB (U61.8), DD2090_4CAM_FFC_Connector_B (J3.98)
USB_TX_N: DD2090_4CAM_FFC_USB (U61.3), DD2090_4CAM_FFC_Connector_B (J3.84)
USB_TX_P: DD2090_4CAM_FFC_USB (U61.4), DD2090_4CAM_FFC_Connector_B (J3.86)
WAKE: DD2090_4CAM_FFC_IMU (U7.9 U12.6), DD2090_4CAM_FFC_Connector_B (J3.68)

## Assembly variants
Production: not fitted J4 J5 R2 R9 R22 R23 R24 R34 R37 R38 R60 RZ28 RZ29